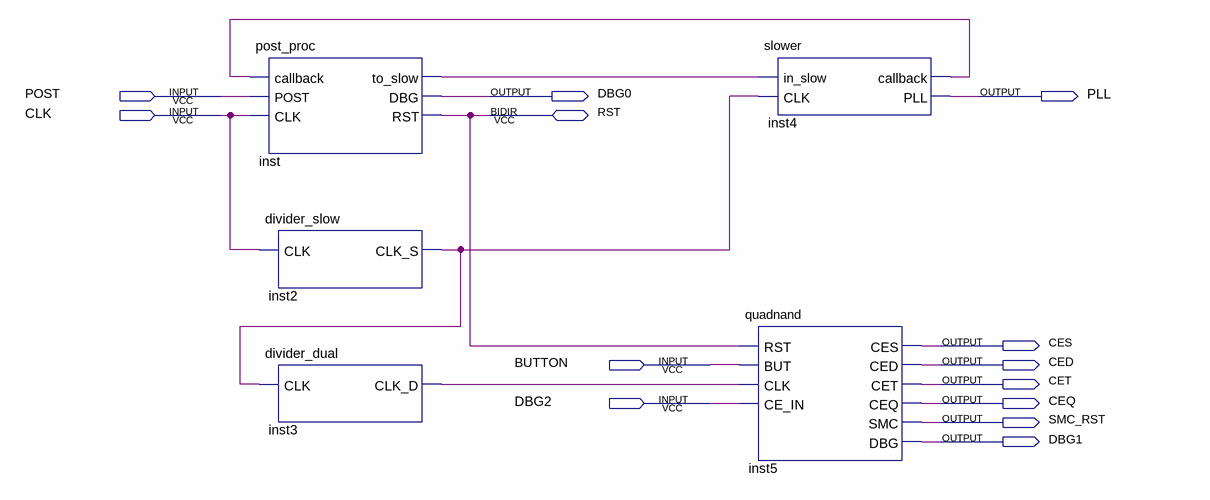
[diagram p0: schematic sheet]
// Quartus schematic main.bdf as structural Verilog: 5 symbols, 13 pins
module main (
  input  POST,
  input  CLK,
  input  BUTTON,
  input  DBG2,
  inout  RST,
  output DBG0,
  output PLL,
  output CES,
  output CED,
  output CET,
  output CEQ,
  output SMC_RST,
  output DBG1
);

  wire inst2_clk_s, inst3_clk_d, inst4_callback, inst_to_slow;

  post_proc inst (.callback(inst4_callback), .POST(POST), .CLK(CLK), .to_slow(inst_to_slow), .DBG(DBG0), .RST(RST));
  divider_slow inst2 (.CLK(CLK), .CLK_S(inst2_clk_s));
  divider_dual inst3 (.CLK(inst2_clk_s), .CLK_D(inst3_clk_d));
  slower inst4 (.in_slow(inst_to_slow), .CLK(inst2_clk_s), .callback(inst4_callback), .PLL(PLL));
  quadnand inst5 (
    .RST(RST), .BUT(BUTTON), .CLK(inst3_clk_d), .CE_IN(DBG2), .CES(CES), .CED(CED), .CET(CET), .CEQ(CEQ),
    .SMC(SMC_RST), .DBG(DBG1));
endmodule
